# Altium schematic sheet Metis 2023 (Schematic) - Shasi.SchDoc
size A; SheetNumber: 1; SheetTotal: 1
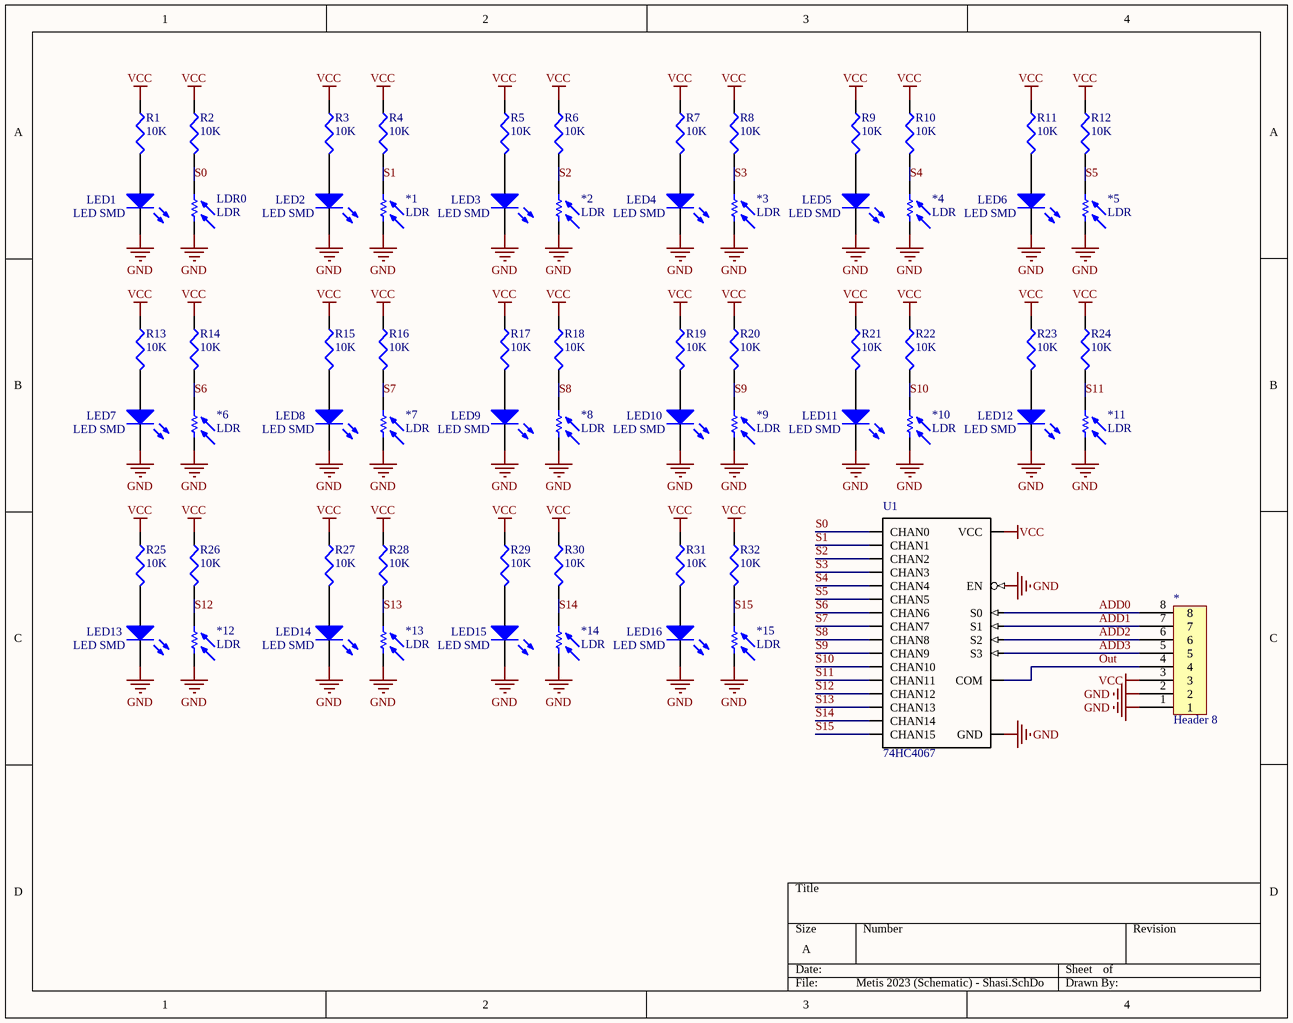
[diagram p0: Metis 2023 (Schematic) - Shasi.SchDoc]

## Parts
*  Header 8  [HEADER 8]
*1  LDR  [LDR]
*2  LDR  [LDR]
*3  LDR  [LDR]
*4  LDR  [LDR]
*5  LDR  [LDR]
*6  LDR  [LDR]
*7  LDR  [LDR]
*8  LDR  [LDR]
*9  LDR  [LDR]
*10  LDR  [LDR]
*11  LDR  [LDR]
*12  LDR  [LDR]
*13  LDR  [LDR]
*14  LDR  [LDR]
*15  LDR  [LDR]
LDR0  LDR  [LDR]
LED1  LED SMD  [MY_LED_SMD]
LED2  LED SMD  [MY_LED_SMD]
LED3  LED SMD  [MY_LED_SMD]
LED4  LED SMD  [MY_LED_SMD]
LED5  LED SMD  [MY_LED_SMD]
LED6  LED SMD  [MY_LED_SMD]
LED7  LED SMD  [MY_LED_SMD]
LED8  LED SMD  [MY_LED_SMD]
LED9  LED SMD  [MY_LED_SMD]
LED10  LED SMD  [MY_LED_SMD]
LED11  LED SMD  [MY_LED_SMD]
LED12  LED SMD  [MY_LED_SMD]
LED13  LED SMD  [MY_LED_SMD]
LED14  LED SMD  [MY_LED_SMD]
LED15  LED SMD  [MY_LED_SMD]
LED16  LED SMD  [MY_LED_SMD]
R1  10K  [MY_RES_SMD_1206]
R2  10K  [MY_RES_SMD_1206]
R3  10K  [MY_RES_SMD_1206]
R4  10K  [MY_RES_SMD_1206]
R5  10K  [MY_RES_SMD_1206]
R6  10K  [MY_RES_SMD_1206]
R7  10K  [MY_RES_SMD_1206]
R8  10K  [MY_RES_SMD_1206]
R9  10K  [MY_RES_SMD_1206]
R10  10K  [MY_RES_SMD_1206]
R11  10K  [MY_RES_SMD_1206]
R12  10K  [MY_RES_SMD_1206]
R13  10K  [MY_RES_SMD_1206]
R14  10K  [MY_RES_SMD_1206]
R15  10K  [MY_RES_SMD_1206]
R16  10K  [MY_RES_SMD_1206]
R17  10K  [MY_RES_SMD_1206]
R18  10K  [MY_RES_SMD_1206]
R19  10K  [MY_RES_SMD_1206]
R20  10K  [MY_RES_SMD_1206]
R21  10K  [MY_RES_SMD_1206]
R22  10K  [MY_RES_SMD_1206]
R23  10K  [MY_RES_SMD_1206]
R24  10K  [MY_RES_SMD_1206]
R25  10K  [MY_RES_SMD_1206]
R26  10K  [MY_RES_SMD_1206]
R27  10K  [MY_RES_SMD_1206]
R28  10K  [MY_RES_SMD_1206]
R29  10K  [MY_RES_SMD_1206]
R30  10K  [MY_RES_SMD_1206]
R31  10K  [MY_RES_SMD_1206]
R32  10K  [MY_RES_SMD_1206]
U1  74HC4067  [*SOIC-24_74HC4067(Primary)]

## Nets
GND: *.1 *.2 *1.2 *2.2 *3.2 *4.2 *5.2 *6.2 *7.2 *8.2 *9.2 *10.2 *11.2 *12.2 *13.2 *14.2 *15.2 LDR0.2 LED1.2(K) LED2.2(K) LED3.2(K) LED4.2(K) LED5.2(K) LED6.2(K) LED7.2(K) LED8.2(K) LED9.2(K) LED10.2(K) LED11.2(K) LED12.2(K) LED13.2(K) LED14.2(K) LED15.2(K) LED16.2(K) U1.P12(GND) U1.P15(EN)
VCC: *.3 R1.1 R2.1 R3.1 R4.1 R5.1 R6.1 R7.1 R8.1 R9.1 R10.1 R11.1 R12.1 R13.1 R14.1 R15.1 R16.1 R17.1 R18.1 R19.1 R20.1 R21.1 R22.1 R23.1 R24.1 R25.1 R26.1 R27.1 R28.1 R29.1 R30.1 R31.1 R32.1 U1.P24(VCC)
ADD0: *.8 U1.P10(S0)
ADD1: *.7 U1.P11(S1)
ADD2: *.6 U1.P14(S2)
ADD3: *.5 U1.P13(S3)
Out: *.4 U1.P1(COM)
S0: LDR0.1 R2.2 U1.P9(CHAN0)
S1: *1.1 R4.2 U1.P8(CHAN1)
S2: *2.1 R6.2 U1.P7(CHAN2)
S3: *3.1 R8.2 U1.P6(CHAN3)
S4: *4.1 R10.2 U1.P5(CHAN4)
S5: *5.1 R12.2 U1.P4(CHAN5)
S6: *6.1 R14.2 U1.P3(CHAN6)
S7: *7.1 R16.2 U1.P2(CHAN7)
S8: *8.1 R18.2 U1.P23(CHAN8)
S9: *9.1 R20.2 U1.P22(CHAN9)
S10: *10.1 R22.2 U1.P21(CHAN10)
S11: *11.1 R24.2 U1.P20(CHAN11)
S12: *12.1 R26.2 U1.P19(CHAN12)
S13: *13.1 R28.2 U1.P18(CHAN13)
S14: *14.1 R30.2 U1.P17(CHAN14)
S15: *15.1 R32.2 U1.P16(CHAN15)
NetLED1_1: LED1.1(A) R1.2
NetLED2_1: LED2.1(A) R3.2
NetLED3_1: LED3.1(A) R5.2
NetLED4_1: LED4.1(A) R7.2
NetLED5_1: LED5.1(A) R9.2
NetLED6_1: LED6.1(A) R11.2
NetLED7_1: LED7.1(A) R13.2
NetLED8_1: LED8.1(A) R15.2
NetLED9_1: LED9.1(A) R17.2
NetLED10_1: LED10.1(A) R19.2
NetLED11_1: LED11.1(A) R21.2
NetLED12_1: LED12.1(A) R23.2
NetLED13_1: LED13.1(A) R25.2
NetLED14_1: LED14.1(A) R27.2
NetLED15_1: LED15.1(A) R29.2
NetLED16_1: LED16.1(A) R31.2

## Library data of the parts
R1-R32 = RES SMD 1206
U1 = 74HC4067: Analog Switch/Analog Multiplexer Single 16:1 24-Pin SSOP T/R; MF: Nexperia; Package: None; Price: None; SnapEDA_Link: https://www.snapeda.com/parts/74HC4067/Nexperia/view-part/?ref=snap; MP: 74HC4067; Availability: Not in stock; Check_prices: https://www.snapeda.com/parts/74HC4067/Nexperia/view-part/?ref=eda; Value: *